# EAGLE design HPMFeatherWing (EAGLE 7.6.0)
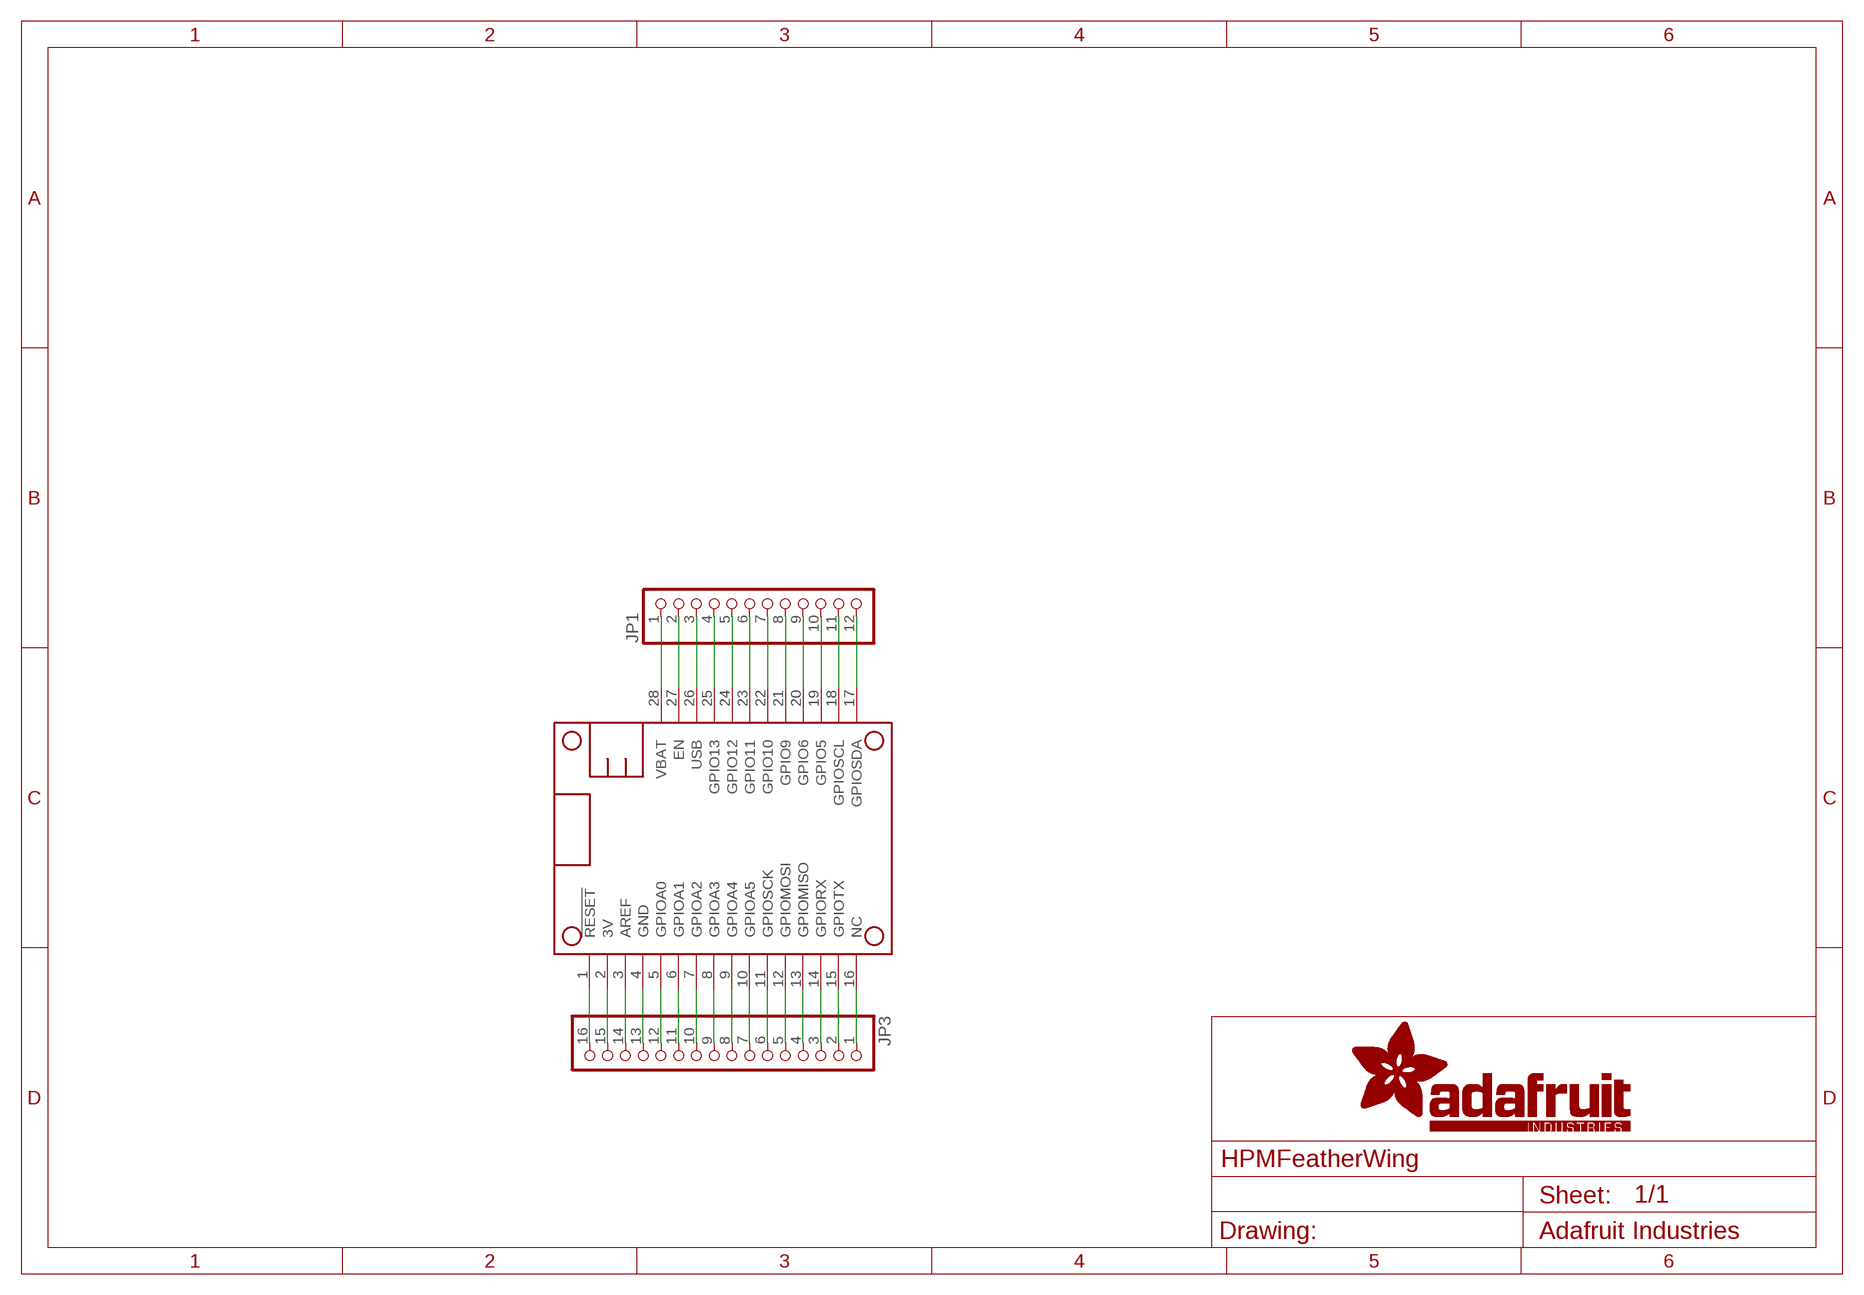
[diagram p0: schematic, sheet 1]

## Parts
JP1  HEADER-1X1276MIL  [1X12_ROUND_76MIL]
JP3  HEADER-1X16_76MIL  [1X16_ROUND_76MIL]
MS1  FEATHERWING  [FEATHERWING]

## Nets
3V: JP3.15 MS1.2(3V)
AREF: JP3.14 MS1.3(AREF)
N$1: JP1.2 MS1.27(EN)
N$2: JP3.1 MS1.16(NC)
N$3: JP1.4 MS1.25(GPIO13)
N$7: JP3.4 MS1.13(GPIOMISO)
N$8: JP3.5 MS1.12(GPIOMOSI)
N$9: JP3.6 MS1.11(GPIOSCK)
N$10: JP3.7 MS1.10(GPIOA5)
N$11: JP3.8 MS1.9(GPIOA4)
N$12: JP3.9 MS1.8(GPIOA3)
N$13: JP3.10 MS1.7(GPIOA2)
N$14: JP3.11 MS1.6(GPIOA1)
N$15: JP3.12 MS1.5(GPIOA0)
N$18: JP3.16 MS1.1(!RESET)
N$19: JP1.6 MS1.23(GPIO11)
N$20: JP1.7 MS1.22(GPIO10)
N$21: JP1.8 MS1.21(GPIO9)
N$22: JP1.9 MS1.20(GPIO6)
N$23: JP1.10 MS1.19(GPIO5)
N$24: JP1.11 MS1.18(GPIOSCL)
N$25: JP1.12 MS1.17(GPIOSDA)
N$29: JP3.3 MS1.14(GPIORX)
N$54: JP3.2 MS1.15(GPIOTX)
N$55: JP3.13 MS1.4(GND)
N$92: JP1.5 MS1.24(GPIO12)
USB: JP1.3 MS1.26(USB)
VBAT: JP1.1 MS1.28(VBAT)

## Library data of the parts
JP1 = microbuilder:HEADER-1X12
JP3 = microbuilder:HEADER-1X16: PIN HEADER
MS1 = microbuilder:FEATHERWING

## Board
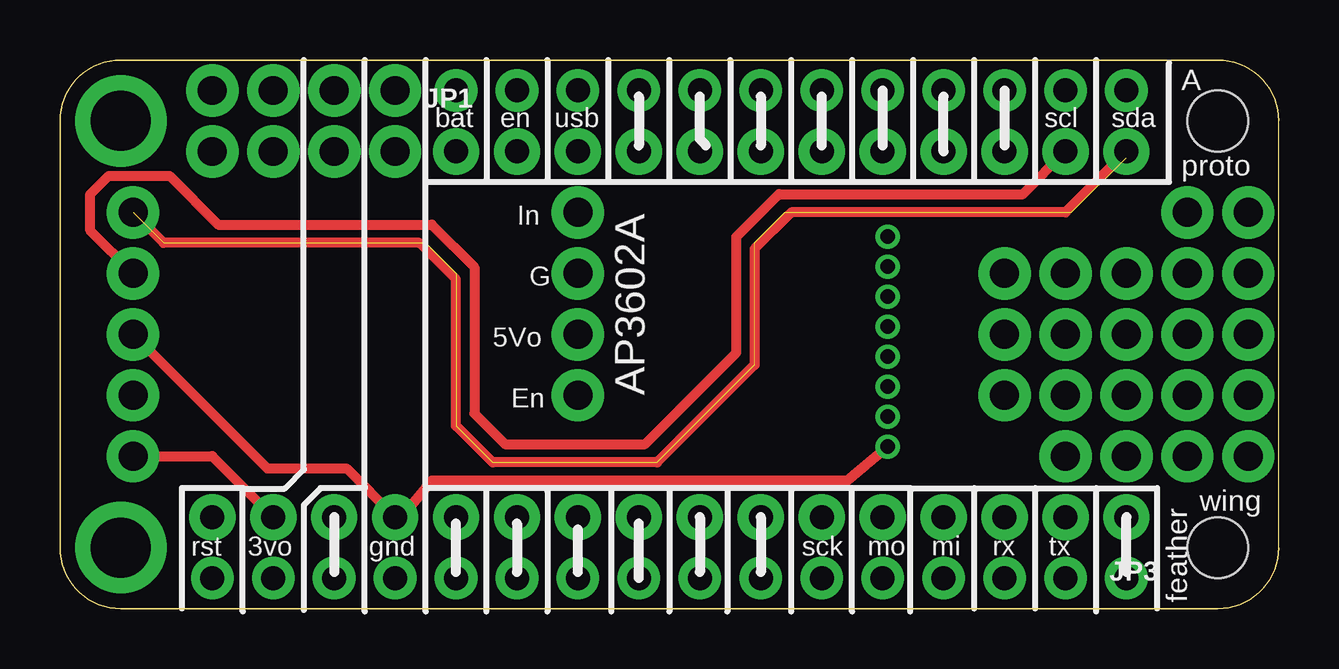
[diagram p1: board, top side]
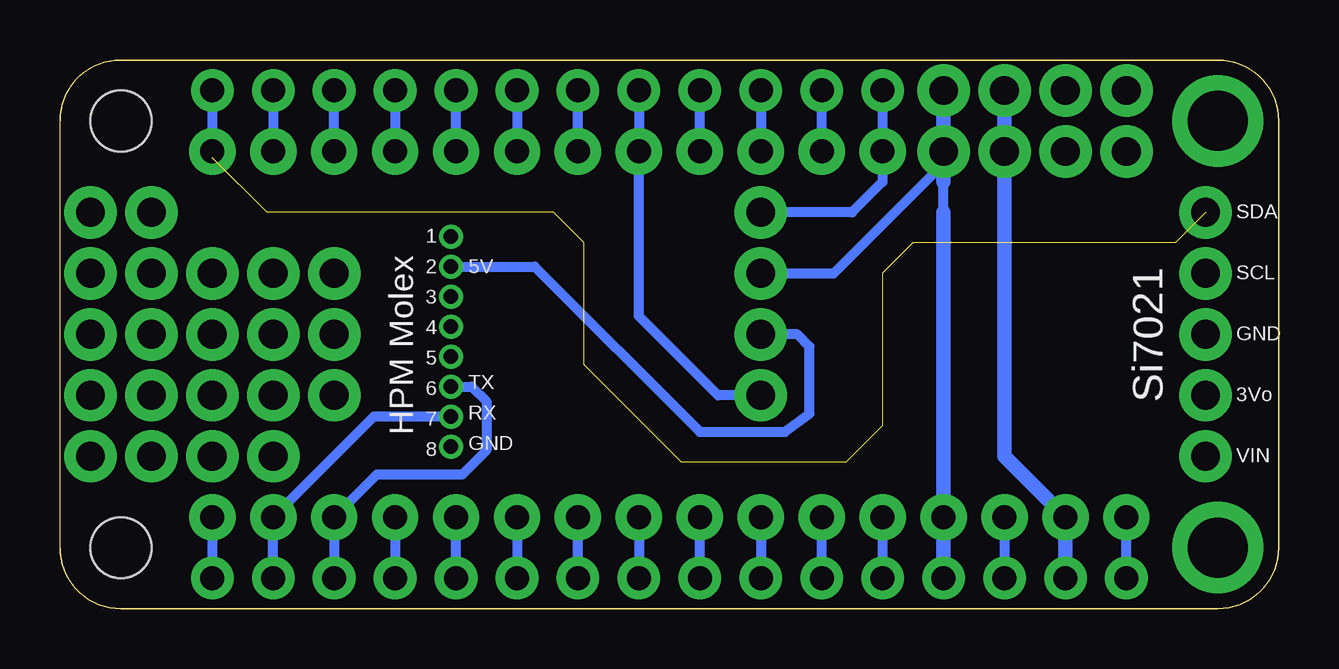
[diagram p2: board, bottom side, seen from below]

Size 50.8 x 22.86 mm. Coordinates in mm from the lower left corner, seen from the top.
Outline: 50.8,20.32 arc90 48.26,22.86 2.54,22.86 arc90 0,20.32 0,2.54 arc90 2.54,0 48.26,0 arc90 50.8,2.54
Copper layers (1*16): Top 0.035mm / dielectric 1.5mm / Bottom 0.035mm
Design rules "adafruit": minimum track width 8mil, minimum drill 15.5mil, track to track 8mil, track to pad 8mil, pad to pad 8mil, via to via 8mil, smd to smd 8mil, copper to edge 10mil, drill to drill 8mil, minimum pad ring 10mil, minimum via ring 8mil, stop-mask expansion 2mil, vias tented up to drill 20mil, thermal gap 10mil

### Footprints (pad centres in the part's own frame; a part is rotated, then mirrored left to right if it is on the bottom)
1X12_ROUND_76MIL = drill 1 pad 1.93: 1 -13.97,0; 2 -11.43,0; 3 -8.89,0; 4 -6.35,0; 5 -3.81,0; 6 -1.27,0; 7 1.27,0; 8 3.81,0; 9 6.35,0; 10 8.89,0; 11 11.43,0; 12 13.97,0
1X16_ROUND_76MIL = drill 1 pad 1.93: 1 -19.05,0; 2 -16.51,0; 3 -13.97,0; 4 -11.43,0; 5 -8.89,0; 6 -6.35,0; 7 -3.81,0; 8 -1.27,0; 9 1.27,0; 10 3.81,0; 11 6.35,0; 12 8.89,0; 13 11.43,0; 14 13.97,0; 15 16.51,0; 16 19.05,0
FEATHERWING = drill 1 pad 1.778: 1 6.35,1.27; 2 8.89,1.27; 3 11.43,1.27; 4 13.97,1.27; 5 16.51,1.27; 6 19.05,1.27; 7 21.59,1.27; 8 24.13,1.27; 9 26.67,1.27; 10 29.21,1.27; 11 31.75,1.27; 12 34.29,1.27; 13 36.83,1.27; 14 39.37,1.27; 15 41.91,1.27; 16 44.45,1.27; 17 44.45,21.59; 18 41.91,21.59; 19 39.37,21.59; 20 36.83,21.59; 21 34.29,21.59; 22 31.75,21.59; 23 29.21,21.59; 24 26.67,21.59; 25 24.13,21.59; 26 21.59,21.59; 27 19.05,21.59; 28 16.51,21.59 | drill 2.5 pad 3.81: P$1 2.54,20.32; P$2 2.54,2.54 | hole 2.54: 48.26,20.32; 48.26,2.54

### Placement (x,y rotation side)
JP1  30.48,19.05 0 top
JP3  25.4,3.81 180 top
MS1  0,0 0 top

### Tracks (layer width: path | path; a pad name or v marks a point on that pad's centre or on a via)
3V  (via drill 1.2 pad 2.18)
  Bottom 0.61: MS1.2 JP3.15 11.43,6.35 v11.43,19.05 v11.43,21.59
AREF
  Bottom 0.406: JP3.14 MS1.3
N$1
  Bottom 0.406: JP1.2 MS1.27
N$2
  Bottom 0.406: JP3.1 MS1.16
N$3
  Bottom 0.406: JP1.4 MS1.25
N$7
  Bottom 0.406: JP3.4 MS1.13
N$8
  Bottom 0.406: MS1.12 JP3.5
N$9
  Bottom 0.406: JP3.6 MS1.11
N$10
  Bottom 0.406: MS1.10 JP3.7
N$11
  Bottom 0.406: JP3.8 MS1.9
N$12
  Bottom 0.406: MS1.8 JP3.9
N$13
  Bottom 0.406: JP3.10 MS1.7
N$14
  Bottom 0.406: MS1.6 JP3.11
N$15
  Bottom 0.406: JP3.12 MS1.5
N$16  (via drill 0.6)
  other vias: 34.5,15.5
N$17  (via drill 0.6, 1.2 pad 2.18)
  Bottom 0.406: v34.5,14.25 31.01,14.25 24.13,7.37 20.57,7.37 19.56,8.13 19.56,10.92 20.07,11.43 v21.59,11.43
N$18
  Bottom 0.406: MS1.1 JP3.16
N$19
  Bottom 0.406: JP1.6 MS1.23
N$20
  Bottom 0.406: MS1.22 JP1.7
N$21
  Bottom 0.406: JP1.8 MS1.21
N$22
  Bottom 0.406: MS1.20 JP1.9
N$23
  Bottom 0.406: JP1.10 MS1.19
N$24
  Bottom 0.406: MS1.18 JP1.11
N$25
  Bottom 0.406: MS1.17 JP1.12
N$26  (via drill 0.6)
  other vias: 34.5,13
N$27  (via drill 0.6)
  other vias: 34.5,11.75
N$28  (via drill 0.6)
  other vias: 34.5,10.5
N$29  (via drill 0.6)
  Bottom 0.406: v34.5,9.25 33.63,9.25 33.02,8.64 33.02,6.6 34.04,5.59 37.59,5.59 JP3.3 MS1.14
N$30  (via drill 1.2 pad 2.18)
  other vias: 8.89,21.59
N$31  (via drill 1.2 pad 2.18)
  other vias: 8.89,19.05
N$32  (via drill 1.2 pad 2.18)
  other vias: 6.35,19.05
N$33  (via drill 1.2 pad 2.18)
  other vias: 6.35,21.59
N$36  (via drill 1.2 pad 2.18)  (11 unrouted)
  Top 0.406: 44.45,19.05 41.91,16.51 30.48,16.51 28.96,14.99 28.96,10.16 24.89,6.1 18.03,6.1 16.51,7.62 16.51,13.72 14.99,15.24 4.32,15.24 3.3,16.26
  other vias: 3.05,16.51
N$37  (via drill 1.2 pad 2.18)
  Top 0.406: v3.05,13.97 1.27,15.75 1.27,17.27 2.03,18.03 4.57,18.03 6.6,16 15.49,16 17.27,14.22 17.27,8.13 18.54,6.86 24.38,6.86 28.19,10.67 28.19,15.49 29.97,17.27 40.13,17.27 41.91,19.05
N$42  (via drill 1.2 pad 2.18)
  Top 0.406: v3.05,11.43 8.64,5.84 11.94,5.84 13.97,3.81
N$43  (via drill 1.2 pad 2.18)
  other vias: 3.05,8.89
N$48  (via drill 1.2 pad 2.18)
  Top 0.406: v3.05,6.35 6.35,6.35 8.89,3.81
N$54  (via drill 0.6)
  Bottom 0.406: MS1.15 JP3.2 37.72,8 v34.5,8
N$55  (via drill 0.6, 1.2 pad 2.18)
  Top 0.406: v34.5,6.75 32.83,5.33 15.49,5.33 14.22,3.81 JP3.13
  Bottom 0.406: 13.97,16.51 13.97,17.78 | v21.59,13.97 18.54,13.97 13.97,18.54
  Bottom 0.61: MS1.4 JP3.13 13.97,16.51 | v13.97,21.59 v13.97,19.05 13.97,18.54 13.97,17.78
N$66  (via drill 1.2 pad 2.18)
  other vias: 44.45,8.89
N$75  (via drill 1.2 pad 2.18)
  other vias: 46.99,6.35
N$82  (via drill 1.2 pad 2.18)
  other vias: 41.91,6.35
N$83  (via drill 1.2 pad 2.18)
  other vias: 46.99,8.89
N$89  (via drill 1.2 pad 2.18)
  other vias: 41.91,13.97
N$92  (via drill 1.2 pad 2.18)
  Bottom 0.406: v21.59,8.89 23.37,8.89 26.67,12.19 JP1.5 MS1.24
N$93  (via drill 1.2 pad 2.18)
  other vias: 41.91,11.43
N$94  (via drill 1.2 pad 2.18)
  other vias: 49.53,11.43
N$96  (via drill 1.2 pad 2.18)
  other vias: 41.91,8.89
N$97  (via drill 1.2 pad 2.18)
  other vias: 44.45,6.35
N$100  (via drill 1.2 pad 2.18)
  other vias: 46.99,13.97
N$101  (via drill 1.2 pad 2.18)
  other vias: 49.53,8.89
N$102  (via drill 1.2 pad 2.18)
  other vias: 46.99,16.51
N$103  (via drill 1.2 pad 2.18)
  other vias: 44.45,13.97
N$104  (via drill 1.2 pad 2.18)
  other vias: 44.45,11.43
N$109  (via drill 1.2 pad 2.18)
  other vias: 49.53,6.35
N$111  (via drill 1.2 pad 2.18)
  other vias: 39.37,8.89
N$113  (via drill 1.2 pad 2.18)
  other vias: 39.37,11.43
N$119  (via drill 1.2 pad 2.18)
  other vias: 49.53,16.51
N$124  (via drill 1.2 pad 2.18)
  other vias: 49.53,13.97
N$132  (via drill 1.2 pad 2.18)
  other vias: 39.37,13.97
N$133  (via drill 1.2 pad 2.18)
  other vias: 46.99,11.43
USB
  Bottom 0.406: MS1.26 JP1.3
VBAT  (via drill 1.2 pad 2.18)
  Bottom 0.406: MS1.28 JP1.1 16.51,17.78 17.78,16.51 v21.59,16.51

### Text on the board
tPlace: A | bat | en | usb | scl | sda | proto | In | G | 5Vo | AP3602A | En | wing | rst | 3vo | gnd | sck | mo | mi | rx | tx | feather
bPlace: SDA | 1 | HPM Molex | SCL | Si7021 | 5V | 2 | 3 | GND | 4 | 5 | 3Vo | TX | 6 | RX | 7 | GND | VIN | 8